# Altium schematic sheet Storage.SchDoc
size A; SheetNumber: 5; SheetTotal: 7
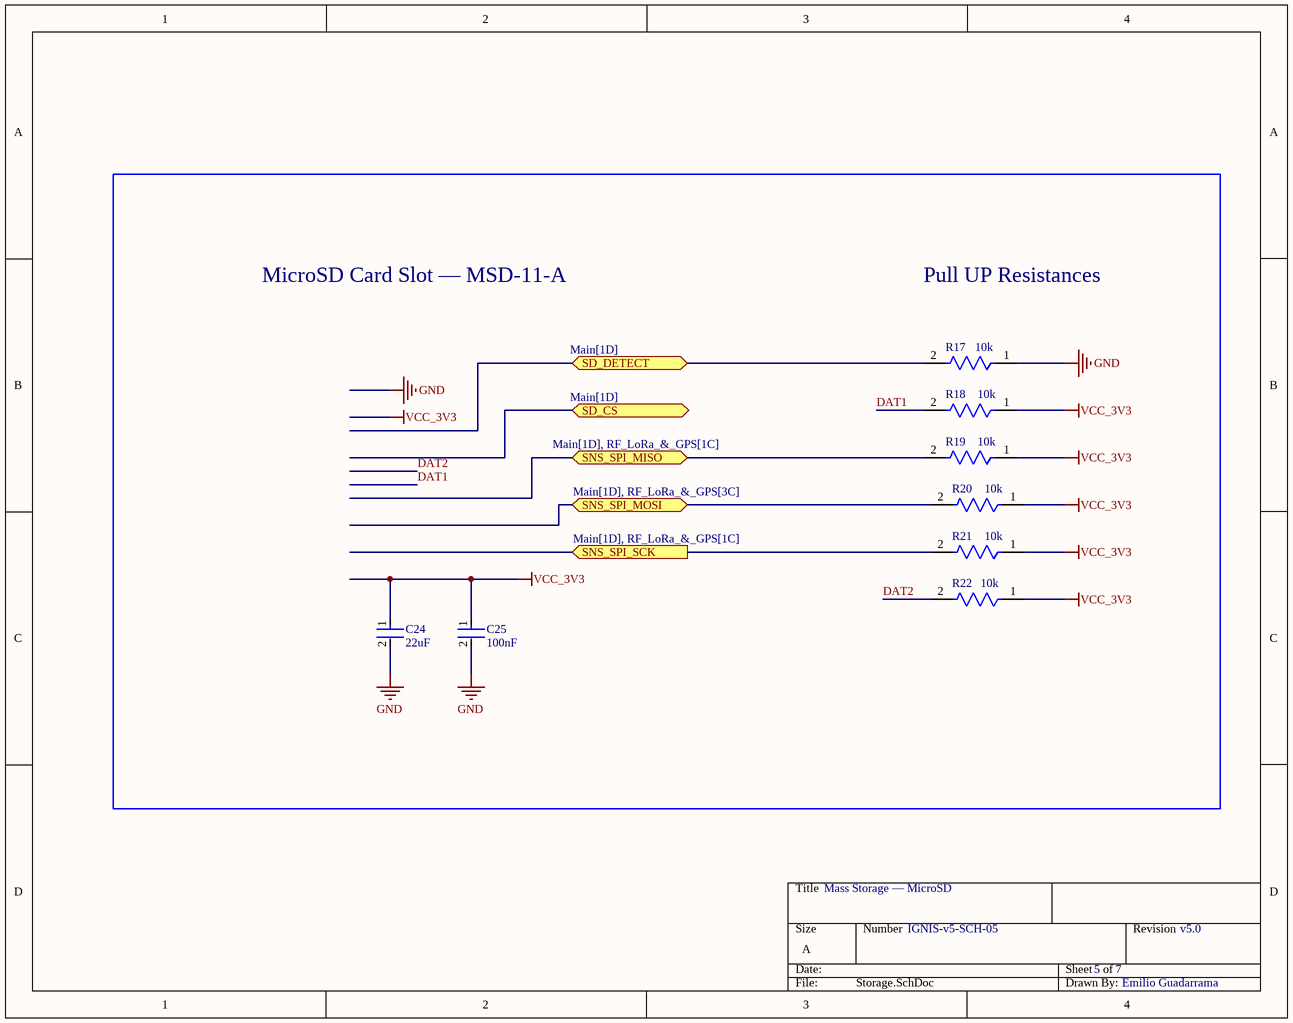
[diagram p0: Storage.SchDoc]

## Parts
C24  22uF  [FP-C0805C-DN-MFG]
C25  100nF  [FP-C0805C-DN-MFG]
R17  10k  [FP-MCT0603-IPC_A]
R18  10k  [FP-MCT0603-IPC_A]
R19  10k  [FP-MCT0603-IPC_A]
R20  10k  [FP-MCT0603-IPC_A]
R21  10k  [FP-MCT0603-IPC_A]
R22  10k  [FP-MCT0603-IPC_A]

## Ports
SD_CS (bidir, see Main[1D]), SD_DETECT (bidir, see Main[1D]), SNS_SPI_MISO (bidir, see Main[1D], RF_LoRa_&_GPS[1C]), SNS_SPI_MOSI (bidir, see Main[1D], RF_LoRa_&_GPS[3C]), SNS_SPI_SCK (in, see Main[1D], RF_LoRa_&_GPS[1C])

## Nets
GND: C24.2 C25.2 R17.1
VCC_3V3: C24.1 C25.1 R18.1 R19.1 R20.1 R21.1 R22.1
DAT1: R18.2
DAT2: R22.2
SD_DETECT: R17.2 ; port SD_DETECT
SNS_SPI_MISO: R19.2 ; port SNS_SPI_MISO
SNS_SPI_MOSI: R20.2 ; port SNS_SPI_MOSI
SNS_SPI_SCK: R21.2 ; port SNS_SPI_SCK

## Notes on the sheet
- MicroSD Card Slot — MSD-11-A
- Pull UP Resistances
- Mass Storage — MicroSD
- IGNIS-v5-SCH-05
- 5
- 7
- v5.0
- Emilio Guadarrama

## Library data of the parts
C24 C25 = CMP-2007-00279-2: CAP CER 0.1UF 50V X7R 0805; Manufacturer Part Number: C0805C104K5RACTU; Manufacturer: KEMET; Tolerance: 0.1; Temperature Coefficient: 30ppm/°C; Material: Ceramic; Device Class L2: Capacitors; Temperature Range Low: -55°C; Voltage Rating: 50 V; Digikey Description: CAP CER 0.1UF 50V X7R 0805; Category: Cap; ComponentLink2Description: Datasheet; Octopart: https://octopart.com/c0805c104k5ractu-kemet-143926; RoHS: TRUE; ComponentLink2URL: https://content.kemet.com/datasheets/KEM_C1003_C0G_SMD.pdf; Temperature Characteristic: X7R; Temperature: -55°C to +125°C; Height: 0.88mm; Temperature Range High: +125°C; Device Class L1: Passive Components; Automotive: No; Lead Free: Yes; Ipc Land Pattern Name: CAPC200125X78; Device Class L3: Ceramic Capacitors; Mouser Description: Cap Ceramic 0.1uF 50V X7R 10% SMD 2.0 x 1.2 mm 125 C Paper T/R; Package: C0805C-DN
  C24: Value: 22 uF; Capacitance: 22 uF
  C25: Value: 100 nF; Capacitance: 100 nF
R17-R22 = CMP-02407-011165-1: RES SMD 100 OHM 1% 1/8W 0603; Temperature Coefficient: 25ppm/°C; Resistance: 10kR; Power Rating: 125mW; Tolerance: 0.1%; Voltage Rating: 75V; Length: 1.55mm; Case Code (Imperial): 0603; Case/Package: 0603; Construction: Rectangular; Package Quantity: 1000; Number of Terminations: 2; Termination: SMD/SMT; Resistor Type: Thin Film; Features: Automotive AEC-Q200; Series: MCT 0603 - Precision; Max Operating Temperature: 155°C; Depth: 0.85mm; Max Power Dissipation: 125mW; Min Operating Temperature: -55°C; Width: 0.033inch; Case Code (Metric): 1608; Packaging: Tape and Reel; Weight: 6.7E-05oz; Military Standard: Not; Height: 0.022inch